# EasyEDA schematic SCH_ZeeKey_2021-09-02.json
TITLE: ZeeKey - Gw Zb USB C; REV: 1.0; Date: 2021-08-31; Sheet: 1/1; Drawn By: TrimVa; Company: Tech4You
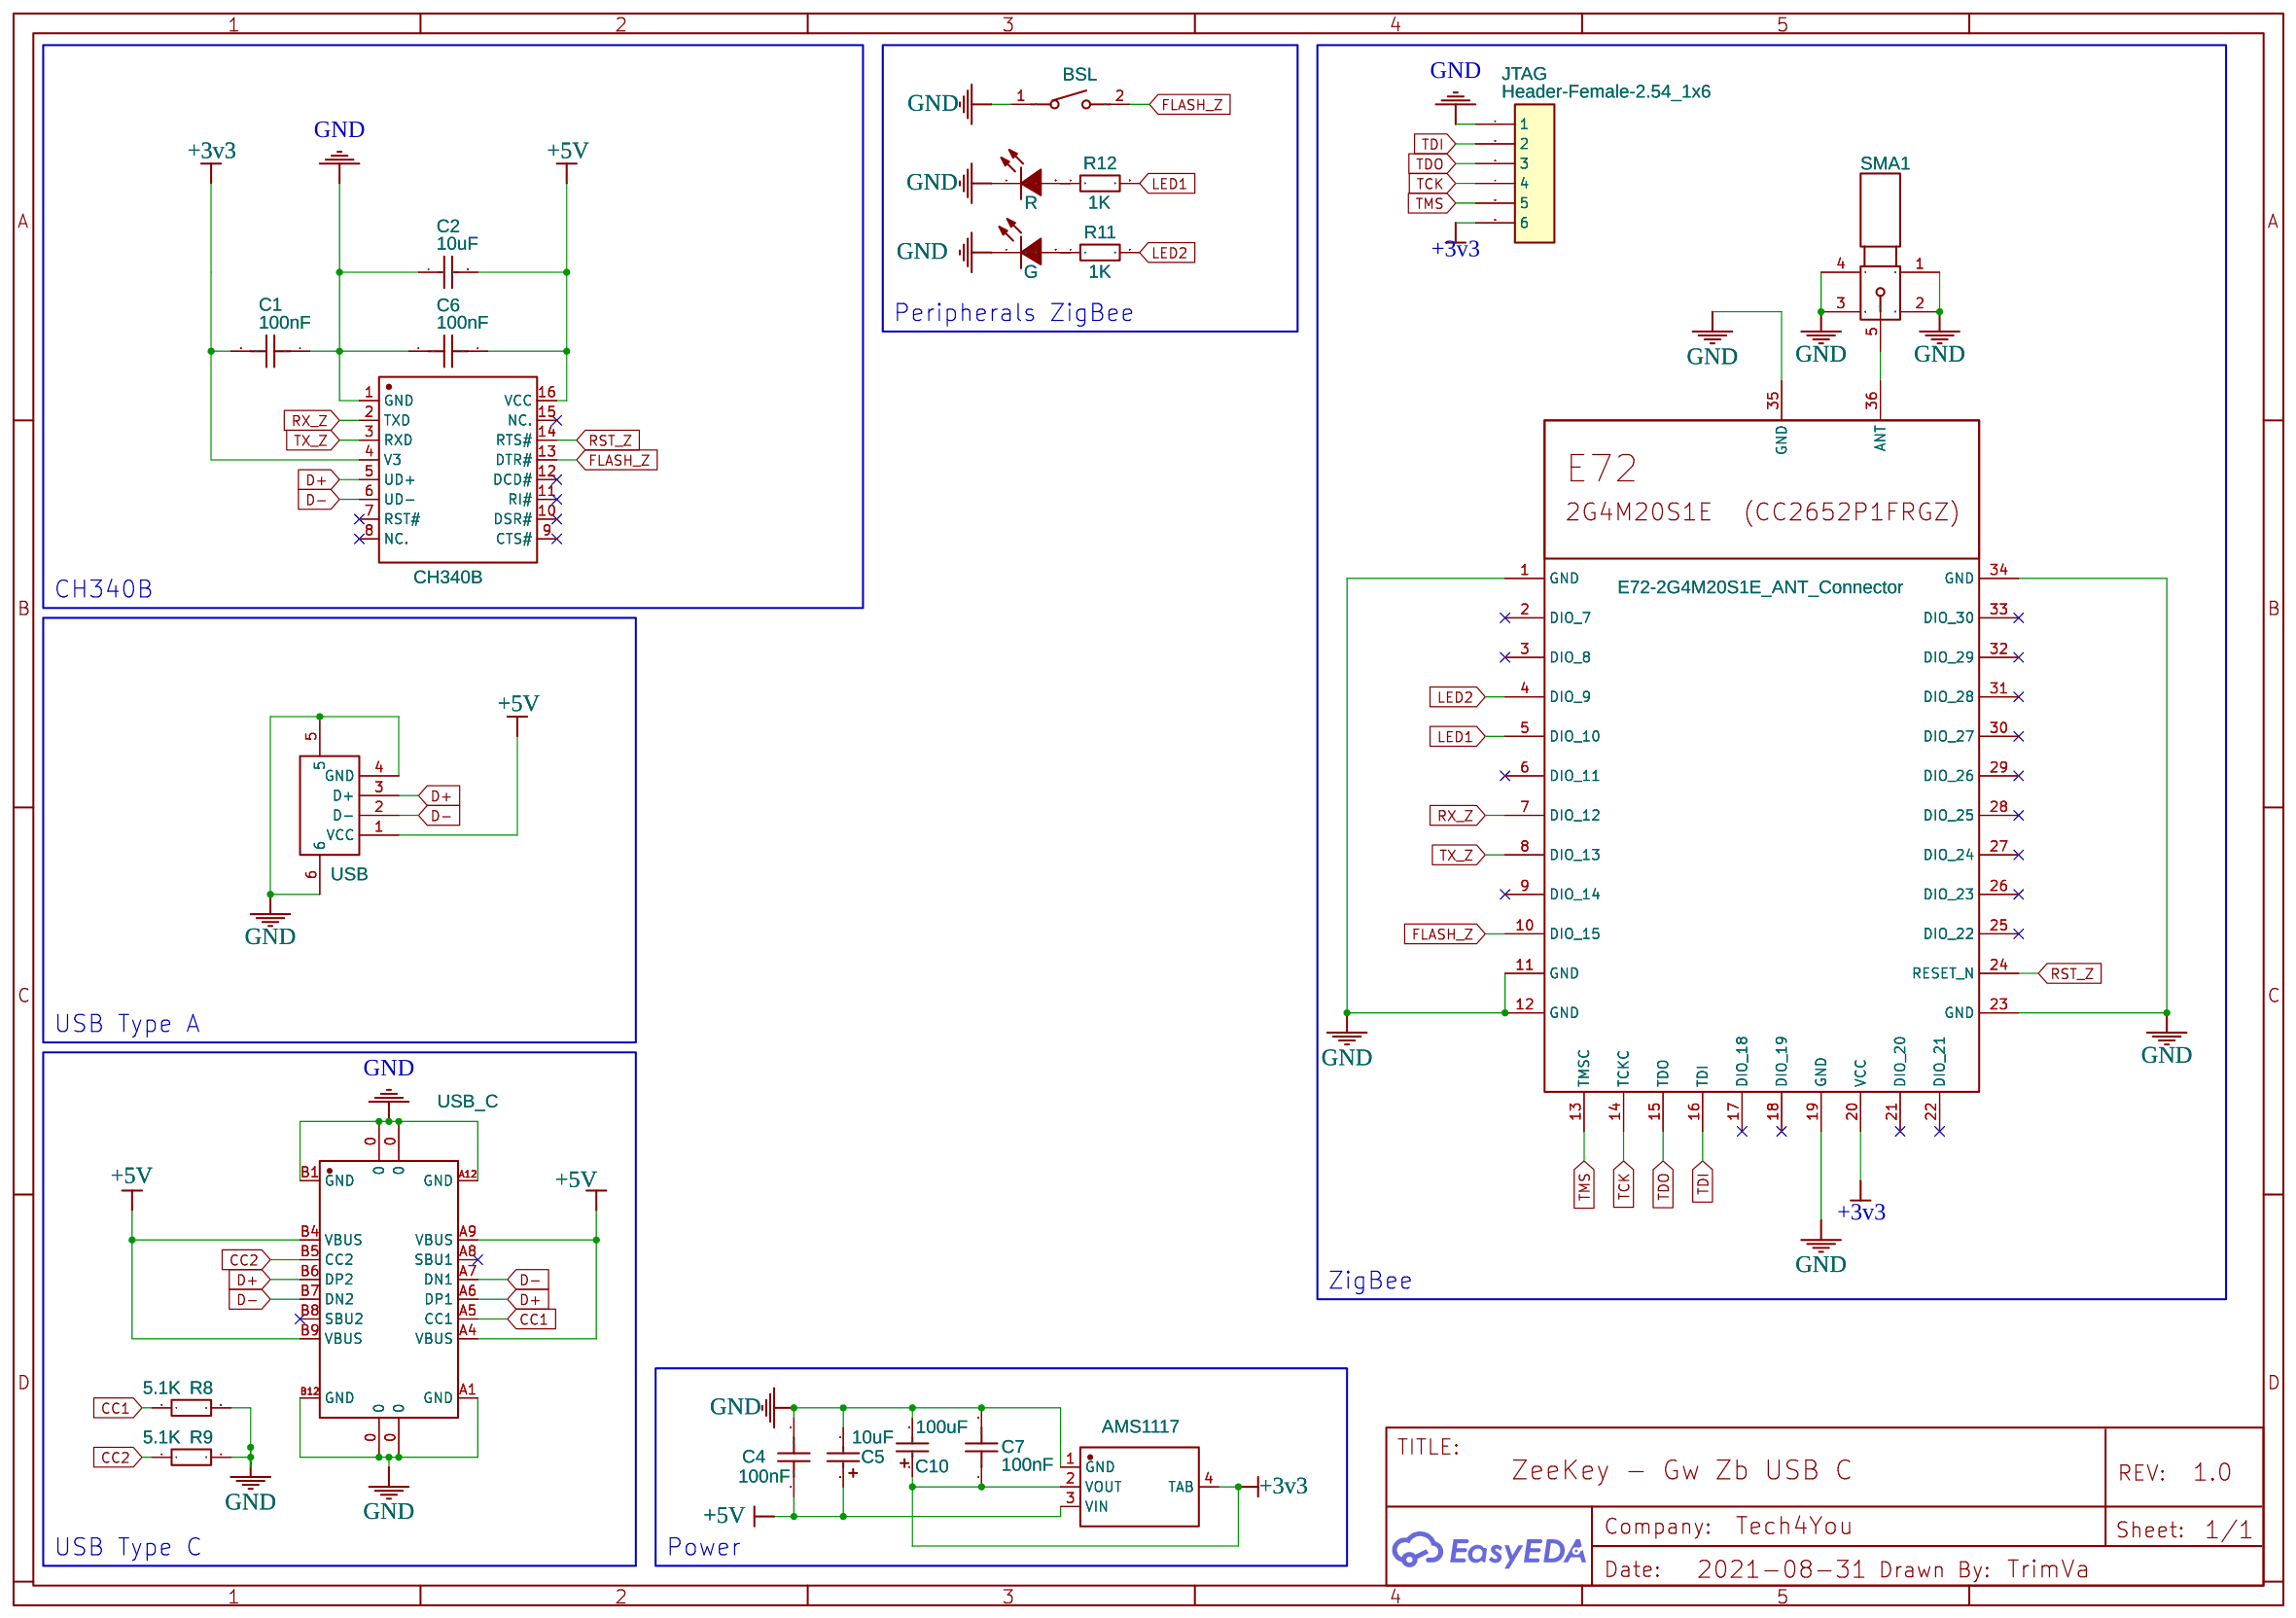
[diagram p0: schematic sheet]

## Parts
AMS1117  AMS1117-3.3_C351784  [SOT-223-3_L6.5-W3.4-P2.30-LS7.0-BR]
BSL  TS-1088-AR02516  [SW-SMD_L4.0-W2.9-LS4.8-1]
C1  100nF  [C0402]
C2  10uF  [C0402]
C4  100nF  [C0402]
C5  10uF  [CAP-SMD_L3.2-W1.6-R-RD]
C6  100nF  [C0402]
C7  100nF  [C0402]
C10  100uF  [CAP-SMD_L3.2-W1.6-R-RD]
CH340B  CH340B  [SOIC-16_L9.9-W3.9-P1.27-LS6.0-BL]
G  G  [LED0805-RD]
GND1  E72-2G4M20S1E_ANT_Connector  [E72-2G4M20S1E ANT_CONNECTOR]
JTAG  Header-Female-2.54_1x6  [1X6 PIN HEADER 2.54MM]
R  R  [LED0805-RD]
R8  5.1K  [R0402]
R9  5.1K  [R0402]
R11  1K  [R0402]
R12  1K  [R0402]
SMA1  BWSMA-KE-P001  [SMA-SMD_BWSMA-KE-P001]
USB  U217-04XN-XXR84  [USB-A-SMD_U217-041N-4BV81]
USB_C  TYPE-C-31-M-12  [USB-C_SMD-TYPE-C-31-M-12]

## Library data of the parts
AMS1117 = AMS1117-3.3_C351784: Supplier: LCSC; Supplier Part: C351784; Manufacturer: PUOLOP; Manufacturer Part: AMS1117-3.3; Contributor: LCSC; JLCPCB Part Class: Extended Part
BSL = TS-1088-AR02516: Supplier: LCSC; Supplier Part: C720478; Manufacturer: XUNPU; Contributor: LCSC; JLCPCB Part Class: Extended Part
C1 C6 = C0402C104M4RACTU: Supplier: LCSC; Supplier Part: C170183; Manufacturer: KEMET; Contributor: LCSC
C2 = CL05A106MQ5NUNC: Supplier: LCSC; Manufacturer: SAMSUNG; Supplier Part: C15525; JLCPCB Part Class: Basic Part
C4 C7 = TCC0402X7R104K160AT: Supplier: LCSC; Supplier Part: C392963; Manufacturer: CCTC; Contributor: LCSC; JLCPCB Part Class: Extended Part
C5 = TAJA106K016RNJ: Supplier: LCSC; Manufacturer: AVX; Supplier Part: C7171; JLCPCB Part Class: Basic Part
C10 = T490A107M006ATE800: Supplier: LCSC; Manufacturer: KEMET; Supplier Part: C122251; JLCPCB Part Class: Extended Part
CH340B = CH340B: Supplier: LCSC; Manufacturer: WCH; Supplier Part: C81010; JLCPCB Part Class: Extended Part
G = 0805G (Green): Supplier: LCSC; Manufacturer: KENTO; Supplier Part: C2297; JLCPCB Part Class: Basic Part
GND1 = E72-2G4M20S1E_ANT_Connector: Manufacturer: Texas Instruments; Manufacturer Part: CC2652P1FRGZ; Supplier: EBYTE; Supplier Part: E72-2G4M20S1E; link: https://www.ebyte.com/en/product-view-news.aspx?id=1002; Contributor: tsura.evgeniy; Manual: https://www.ebyte.com/en/downpdf.aspx?id=1002
JTAG = Header-Female-2.54_1x6: Manufacturer Part: Female header/2.54mm2x3 Female header
R = FC-2012HRK-620D: Supplier: LCSC; Manufacturer: NATIONSTAR; Supplier Part: C84256; JLCPCB Part Class: Basic Part
R8 R9 = RC-02W512JT: Supplier: LCSC; Supplier Part: C258132; Manufacturer: Guangdong Fenghua Advanced Tech; Contributor: LCSC; JLCPCB Part Class: Extended Part
R11 R12 = 0402WGF1001TCE: Supplier: LCSC; Manufacturer: UniOhm; Supplier Part: C11702; JLCPCB Part Class: Basic Part
SMA1 = BWSMA-KE-P001: Supplier: LCSC; Supplier Part: C496550; Manufacturer: BAT WIRELESS; Contributor: LCSC; JLCPCB Part Class: Extended Part
USB = U217-04XN-XXR84: Supplier: LCSC; Supplier Part: C319178; Manufacturer: XKB Enterprise; Contributor: LCSC; JLCPCB Part Class: Extended Part
USB_C = TYPE-C-31-M-12: Supplier: LCSC; Supplier Part: C165948; Manufacturer: Rectangular Connectors - Contacts; Contributor: LCSC; JLCPCB Part Class: Extended Part

## Nets
+3v3: AMS1117.2(VOUT) AMS1117.4(TAB) C1.2 C7.1 C10.1 CH340B.4(V3) GND1.20(VCC) JTAG.6
+5V: AMS1117.3(VIN) C2.2 C4.1 C5.1 C6.1 CH340B.16(VCC) USB.1(VCC) USB_C.A4(VBUS) USB_C.A9(VBUS) USB_C.B4(VBUS) USB_C.B9(VBUS)
GND: AMS1117.1(GND) BSL.1 C1.1 C2.1 C4.2 C5.2 C6.2 C7.2 C10.2 CH340B.1(GND) G.1(K) GND1.1(GND) GND1.11(GND) GND1.12(GND) GND1.19(GND) GND1.23(GND) GND1.34(GND) GND1.35(GND) JTAG.1 R.1(-) R8.2 R9.2 SMA1.1 SMA1.2 SMA1.3 SMA1.4 USB.4(GND) USB.5 USB.6 USB_C.0 USB_C.A1(GND) USB_C.A12(GND) USB_C.B1(GND) USB_C.B12(GND)
CC1: R8.1 USB_C.A5(CC1)
CC2: R9.1 USB_C.B5(CC2)
D+: CH340B.5(UD+) USB.3(D+) USB_C.A6(DP1) USB_C.B6(DP2)
D-: CH340B.6(UD-) USB.2(D-) USB_C.A7(DN1) USB_C.B7(DN2)
FLASH_Z: BSL.2 CH340B.13(DTR#) GND1.10(DIO_15)
LED1: GND1.5(DIO_10) R12.2
LED2: GND1.4(DIO_9) R11.2
RST_Z: CH340B.14(RTS#) GND1.24(RESET_N)
RX_Z: CH340B.2(TXD) GND1.7(DIO_12)
TCK: GND1.14(TCKC) JTAG.4
TDI: GND1.16(TDI) JTAG.2
TDO: GND1.15(TDO) JTAG.3
TMS: GND1.13(TMSC) JTAG.5
TX_Z: CH340B.3(RXD) GND1.8(DIO_13)
Net-(G-2): G.2(A) R11.1
Net-(GND1-36): GND1.36(ANT) SMA1.5
Net-(R-2): R.2(+) R12.1

Not connected (* = marked no-connect by the designer): CH340B 7(RST#)* 8(NC.)* 9(CTS#)* 10(DSR#)* 11(RI#)* 12(DCD#)* 15(NC.)*; GND1 2(DIO_7)* 3(DIO_8)* 6(DIO_11)* 9(DIO_14)* 17(DIO_18)* 18(DIO_19)* 21(DIO_20)* 22(DIO_21)* 25(DIO_22)* 26(DIO_23)* 27(DIO_24)* 28(DIO_25)* 29(DIO_26)* 30(DIO_27)* 31(DIO_28)* 32(DIO_29)* 33(DIO_30)*; USB_C A8(SBU1)* B8(SBU2)*

## Notes on the sheet
- Peripherals ZigBee
- CH340B
- USB Type A
- ZigBee
- USB Type C
- Power
